# EAGLE schematic Estimulema v2 (EAGLE 9.1.0)

## Sheet 1 of 12
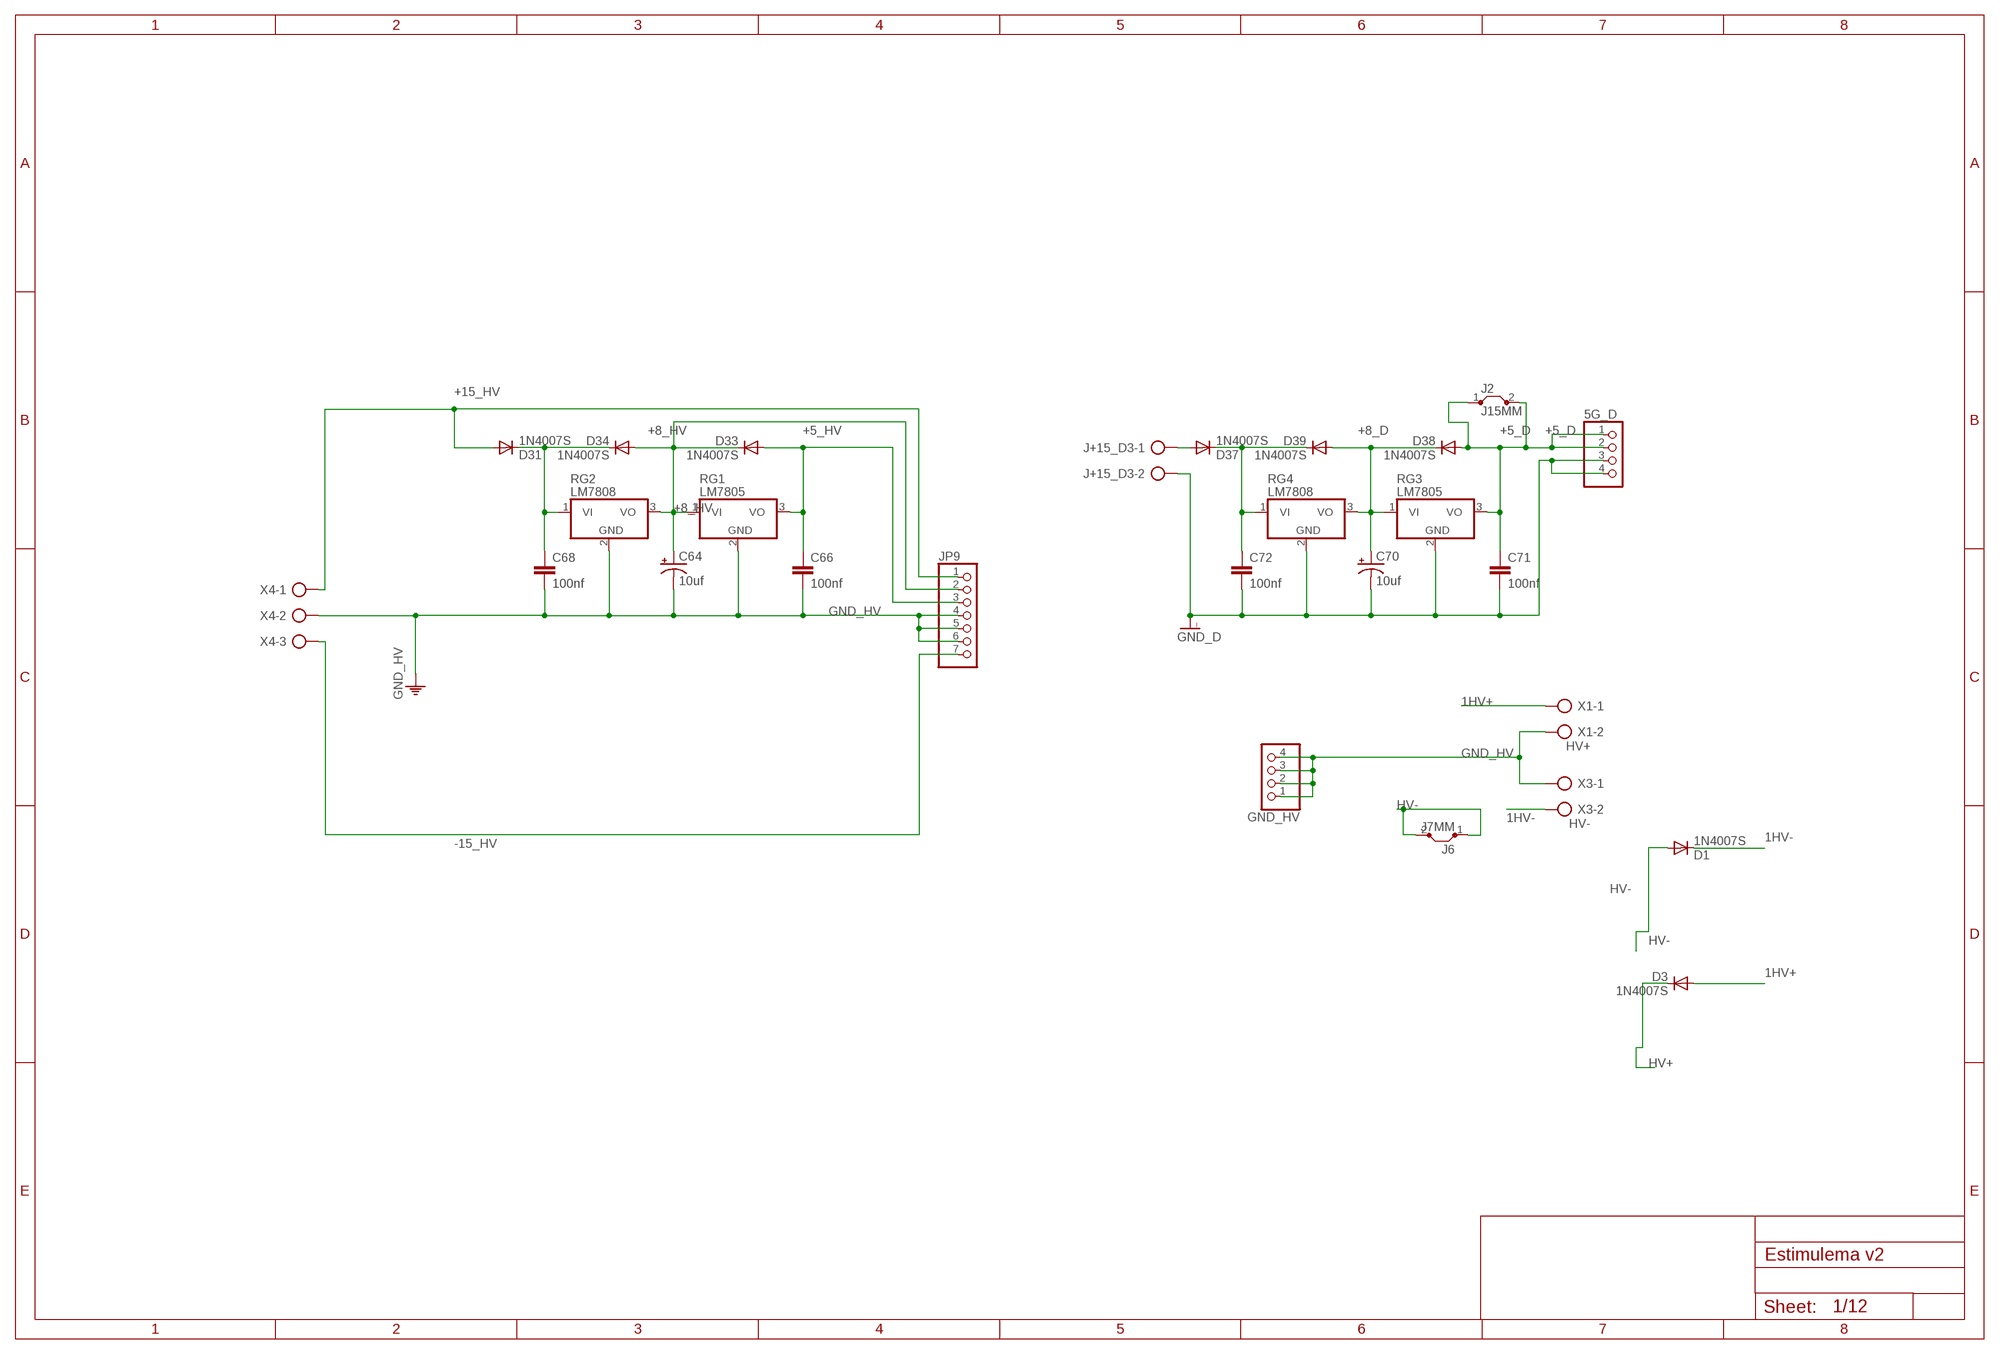
[diagram p0: schematic, sheet 1]

### Parts
5G_D  PINHD-1X4  [1X04]
C64  10uf  CPOL-USE2-5  [E2-5]
C66  100nf  C-EU025-024X044  [C025-024X044]
C68  100nf  C-EU025-024X044  [C025-024X044]
C70  10uf  CPOL-USE2-5  [E2-5]
C71  100nf  C-EU025-024X044  [C025-024X044]
C72  100nf  C-EU025-024X044  [C025-024X044]
D1  1N4007S  DIODO  [DIODO4MM]
D3  1N4007S  DIODO  [DIODO4MM]
D31  1N4007S  DIODO  [DIODO4MM]
D33  1N4007S  DIODO  [DIODO4MM]
D34  1N4007S  DIODO  [DIODO4MM]
D37  1N4007S  DIODO  [DIODO4MM]
D38  1N4007S  DIODO  [DIODO4MM]
D39  1N4007S  DIODO  [DIODO4MM]
GND_HV  PINHD-1X4  [1X04]
J2  J15MM  JUMPERS15MM  [15]
J6  J7MM  JUMPERS7MM  [07]
J+15_D3  AK300/2  [AK300/2]
JP9  PINHD-1X7  [1X07]
RG1  LM7805  7805TV  [TO220V]
RG2  LM7808  7818TV  [TO220V]
RG3  LM7805  7805TV  [TO220V]
RG4  LM7808  7818TV  [TO220V]
X1  HV+  AK300/2  [AK300/2]
X3  HV-  AK300/2  [AK300/2]
X4  AK300/3  [AK300/3]

### Nets
1HV+ [GND_D]: D3.A X1.1
1HV- [GND_D]: D1.C X3.2
+5_D [+5_D]: 5G_D.1 5G_D.2 C71.1 D38.A J2.1 J2.2 RG3.3(VO) ; also sheet 2,5,6,11,12
+5_HV [+5_D]: C66.1 D33.A JP9.3 RG1.3(VO) ; also sheet 2,6
+8_D [SIGNAL]: C70.+ D38.C D39.A RG3.1(VI) RG4.3(VO)
+8_HV [SIGNAL]: C64.+ D33.C D34.A JP9.2 RG1.1(VI) RG2.3(VO)
+15_HV [SIGNAL]: D31.A JP9.1 X4.1 ; also sheet 3,4
-15_HV [SIGNAL]: JP9.7 X4.3 ; also sheet 3,4
GND_D [GND_D]: 5G_D.3 5G_D.4 C70.- C71.2 C72.2 J+15_D3.2 RG3.2(GND) RG4.2(GND) ; also sheet 2,5,11,12
GND_HV [GND_HV1]: C64.- C66.2 C68.2 GND_HV.1 GND_HV.2 GND_HV.3 GND_HV.4 JP9.4 JP9.5 JP9.6 RG1.2(GND) RG2.2(GND) X1.2 X3.1 X4.2 ; also sheet 2,3,4,5,6,10
HV+ [GND_D]: D3.C ; also sheet 3,4,10
HV- [GND_D]: D1.A J6.1 J6.2 ; also sheet 3,4,10
N$9: D37.A J+15_D3.1
N$157 [SIGNAL]: C68.1 D31.C D34.C RG2.1(VI)
N$158 [SIGNAL]: C72.1 D37.C D39.C RG4.1(VI)

## Sheet 2 of 12
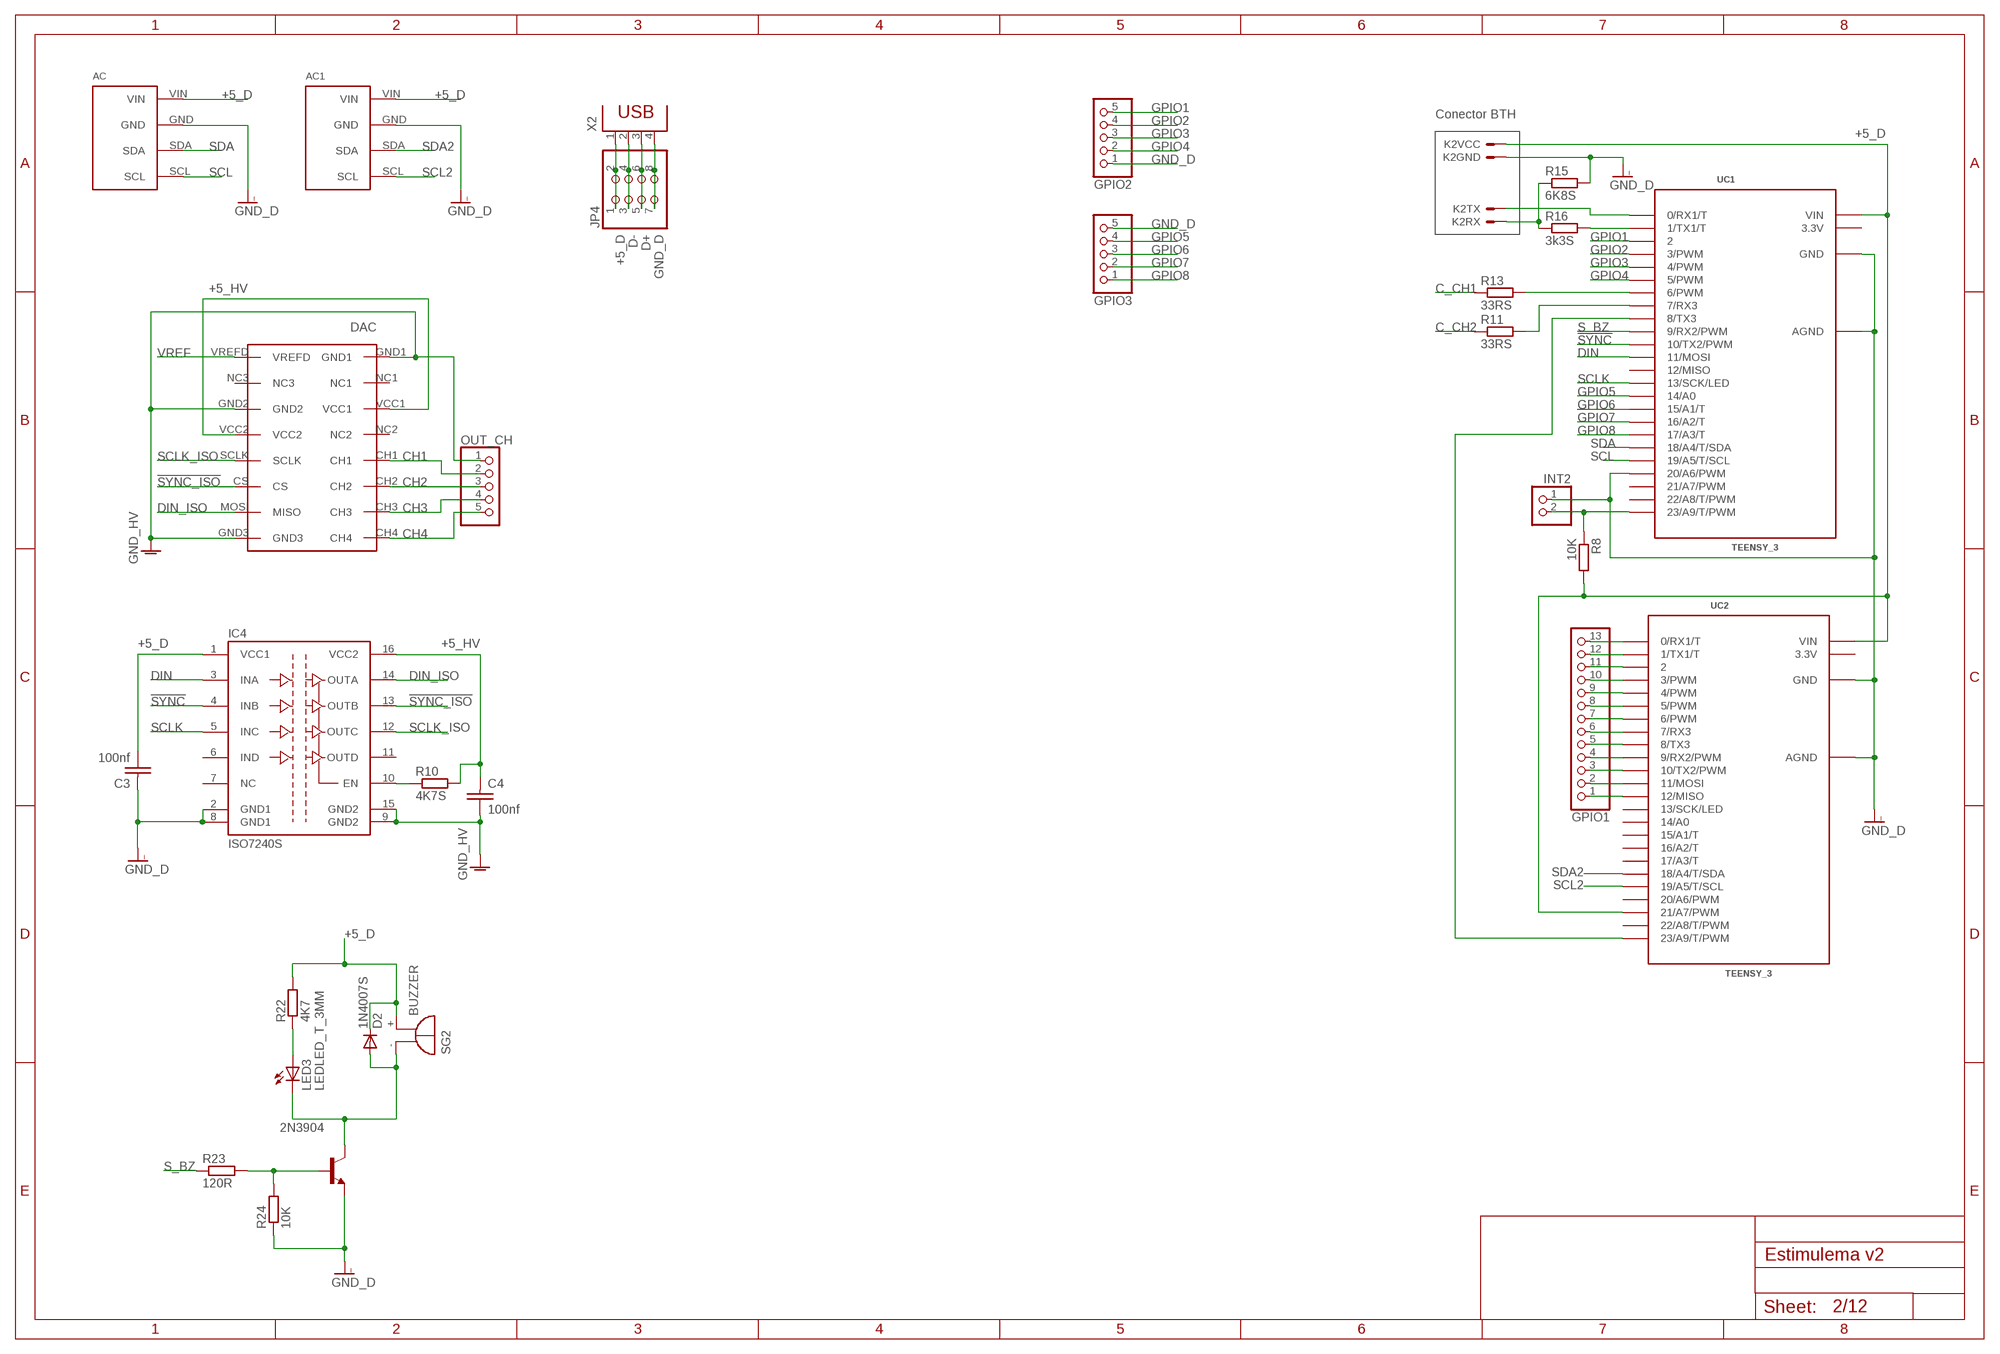
[diagram p1: schematic, sheet 2]

### Parts
2N3904  29-NPN-TO92-EBC  [TO92-EBC]
AC  CONECTOR_ACELEROMETRO_MPU6050CONECTOR_MPU6050  [MPU6050]
AC1  MPU6050  CONECTOR_ACELEROMETRO_MPU6050CONECTOR_MPU6050  [MPU6050]
C3  100nf  CAP_CERAMICO_SMD  [CAP_CER_SMD-0805]
C4  100nf  CAP_CERAMICO_SMD  [CAP_CER_SMD-0805]
D2  1N4007S  DIODO  [DIODO4MM]
DAC  DAC_MODULE  [DACMOD_P]
GPIO1  PINHD-1X13  [1X13]
GPIO2  PINHD-1X5  [1X05]
GPIO3  PINHD-1X5  [1X05]
IC4  ISO7240S  ISO7240_SMDDW  [SO-16DW]
INT2  PINHD-1X2  [1X02]
JP4  PINHD-2X4  [2X04]
K2  HC-06  CONECTOR_BTHC-06HC-06  [CONECTOR_BTHC-06]
LED3  LEDLED_T_3MM  [LED3MM]
OUT_CH  PINHD-1X5  [1X05]
R8  10K  RESISTORSMD_0805  [RESISTENCIA_0805]
R10  4K7S  RESISTORSMD_0805  [RESISTENCIA_0805]
R11  33RS  RESISTORSMD_0805  [RESISTENCIA_0805]
R13  33RS  RESISTORSMD_0805  [RESISTENCIA_0805]
R15  6K8S  RESISTORSMD_0805  [RESISTENCIA_0805]
R16  3k3S  RESISTORSMD_0805  [RESISTENCIA_0805]
R22  4K7  RESISTORSMD_0805  [RESISTENCIA_0805]
R23  120R  RESISTORSMD_0805  [RESISTENCIA_0805]
R24  10K  RESISTORSMD_0805  [RESISTENCIA_0805]
SG2  BUZZER  [BUZZER]
UC1  TEENSY_3  TEENSY_3.0_A_3.2VERSION_MINIMA  [TEENSY_3.0-3.2_DIL]
UC2  TEENSY_3  TEENSY_3.0_A_3.2VERSION_MINIMA  [TEENSY_3.0-3.2_DIL]
X2  PN61729  [PN61729]

### Nets
!SYNC [SIGNAL]: IC4.4(INB) UC1.10(10/TX2/PWM) ; also sheet 6,12
!SYNC_ISO [SIGNAL]: DAC.CS IC4.13(OUTB) ; also sheet 6
+5_D [+5_D]: AC1.VIN AC.VIN C3.2 D2.C IC4.1(VCC1) JP4.1 JP4.2 K2.1 R8.2 R22.2 SG2.+(-) UC1.VIN UC2.21/A7(21/A7/PWM) UC2.VIN X2.1 ; also sheet 1,5,6,11,12
+5_HV [+5_D]: C4.1 DAC.VCC1 DAC.VCC2 IC4.16(VCC2) R10.2 ; also sheet 1,6
C_15D [SIGNAL]: GPIO1.11 UC2.2
C_CH1 [SIGNAL]: R13.1 ; also sheet 5,12
C_CH2 [SIGNAL]: R11.1 ; also sheet 5,12
CH1 [SIGNAL]: DAC.CH1 OUT_CH.2 ; also sheet 3,6
CH2 [SIGNAL]: DAC.CH2 OUT_CH.3 ; also sheet 4,6
CH3 [SIGNAL]: DAC.CH3 OUT_CH.4 ; also sheet 6
CH4 [SIGNAL]: DAC.CH4 OUT_CH.5 ; also sheet 6
D+ [SIGNAL]: JP4.5 JP4.6 X2.3
D- [SIGNAL]: JP4.3 JP4.4 X2.2
DIN [SIGNAL]: IC4.3(INA) UC1.11(11/MOSI) ; also sheet 6,12
DIN_ISO [SIGNAL]: DAC.MOSI(MISO) IC4.14(OUTA) ; also sheet 6
GND_D [GND_D]: 2N3904.E AC1.GND AC.GND GPIO2.1 GPIO3.5 INT2.1 JP4.7 JP4.8 K2.2 R15.2 R24.1 UC1.20/A6(20/A6/PWM) UC1.AGND UC1.GND UC2.AGND UC2.GND X2.4 ; also sheet 1,5,11,12
GND_HV [GND_HV1]: C4.2 DAC.GND1 DAC.GND2 DAC.GND3 IC4.9(GND2) IC4.15(GND2) OUT_CH.1 ; also sheet 1,3,4,5,6,10
GNDI [GND_D]: C3.1 IC4.2(GND1) IC4.8(GND1) ; supply symbol labelled GND_D ; also sheet 6
GPIO1 [SIGNAL]: GPIO2.5 UC1.2
GPIO2 [SIGNAL]: GPIO2.4 UC1.3(3/PWM)
GPIO3 [SIGNAL]: GPIO2.3 UC1.4(4/PWM)
GPIO4 [SIGNAL]: GPIO2.2 UC1.5(5/PWM)
GPIO5 [SIGNAL]: GPIO3.4 UC1.14/A0
GPIO6 [SIGNAL]: GPIO3.3 UC1.15/A1(15/A1/T)
GPIO7 [SIGNAL]: GPIO3.2 UC1.16/A2(16/A2/T)
GPIO8 [SIGNAL]: GPIO3.1 UC1.17/A3(17/A3/T)
N$1: UC1.8(8/TX3) UC2.23/A9(23/A9/T/PWM)
N$6: GPIO1.13 UC2.0(0/RX1/T)
N$7: GPIO1.12 UC2.1(1/TX1/T)
N$10: GPIO1.10 UC2.3(3/PWM)
N$11: GPIO1.9 UC2.4(4/PWM)
N$12: GPIO1.8 UC2.5(5/PWM)
N$14: GPIO1.7 UC2.6(6/PWM)
N$15: GPIO1.6 UC2.7(7/RX3)
N$19: GPIO1.5 UC2.8(8/TX3)
N$20: GPIO1.4 UC2.9(9/RX2/PWM)
N$21: GPIO1.3 UC2.10(10/TX2/PWM)
N$22: GPIO1.2 UC2.11(11/MOSI)
N$23: GPIO1.1 UC2.12(12/MISO)
N$66 [SIGNAL]: IC4.10(EN) R10.1
N$67 [SIGNAL]: R13.2 UC1.6(6/PWM)
N$68 [SIGNAL]: R11.2 UC1.7(7/RX3)
N$69 [SIGNAL]: K2.4 R15.1 R16.1
N$70 [SIGNAL]: R16.2 UC1.1(1/TX1/T)
N$71 [SIGNAL]: K2.3 UC1.0(0/RX1/T)
N$72 [SIGNAL]: LED3.A R22.1
N$73 [SIGNAL]: 2N3904.C D2.A LED3.K(C) SG2.-(+)
N$74 [SIGNAL]: 2N3904.B R23.2 R24.2
N$75 [SIGNAL]: INT2.2 R8.1 UC1.23/A9(23/A9/T/PWM)
S_BZ [SIGNAL]: R23.1 UC1.9(9/RX2/PWM)
SCL [SIGNAL]: AC.SCL UC1.19/A5(19/A5/T/SCL)
SCL2: AC1.SCL UC2.19/A5(19/A5/T/SCL) ; also sheet 11,12
SCLK [SIGNAL]: IC4.5(INC) UC1.13(13/SCK/LED) ; also sheet 6,12
SCLK_ISO [SIGNAL]: DAC.SCLK IC4.12(OUTC) ; also sheet 6
SDA [SIGNAL]: AC.SDA UC1.18/A4(18/A4/T/SDA)
SDA2: AC1.SDA UC2.18/A4(18/A4/T/SDA) ; also sheet 11,12
VREF [SIGNAL]: DAC.VREFD ; also sheet 3,4,6
Unconnected: DAC.NC1 DAC.NC2 DAC.NC3 IC4.6(IND) IC4.7(NC) IC4.11(OUTD) UC1.12(12/MISO) UC1.21/A7(21/A7/PWM) UC1.22/A8(22/A8/T/PWM) UC2.13(13/SCK/LED) UC2.14/A0 UC2.15/A1(15/A1/T) UC2.16/A2(16/A2/T) UC2.17/A3(17/A3/T) UC2.20/A6(20/A6/PWM) UC2.22/A8(22/A8/T/PWM)

### Notes on the sheet
- Conector BTH

## Sheet 3 of 12
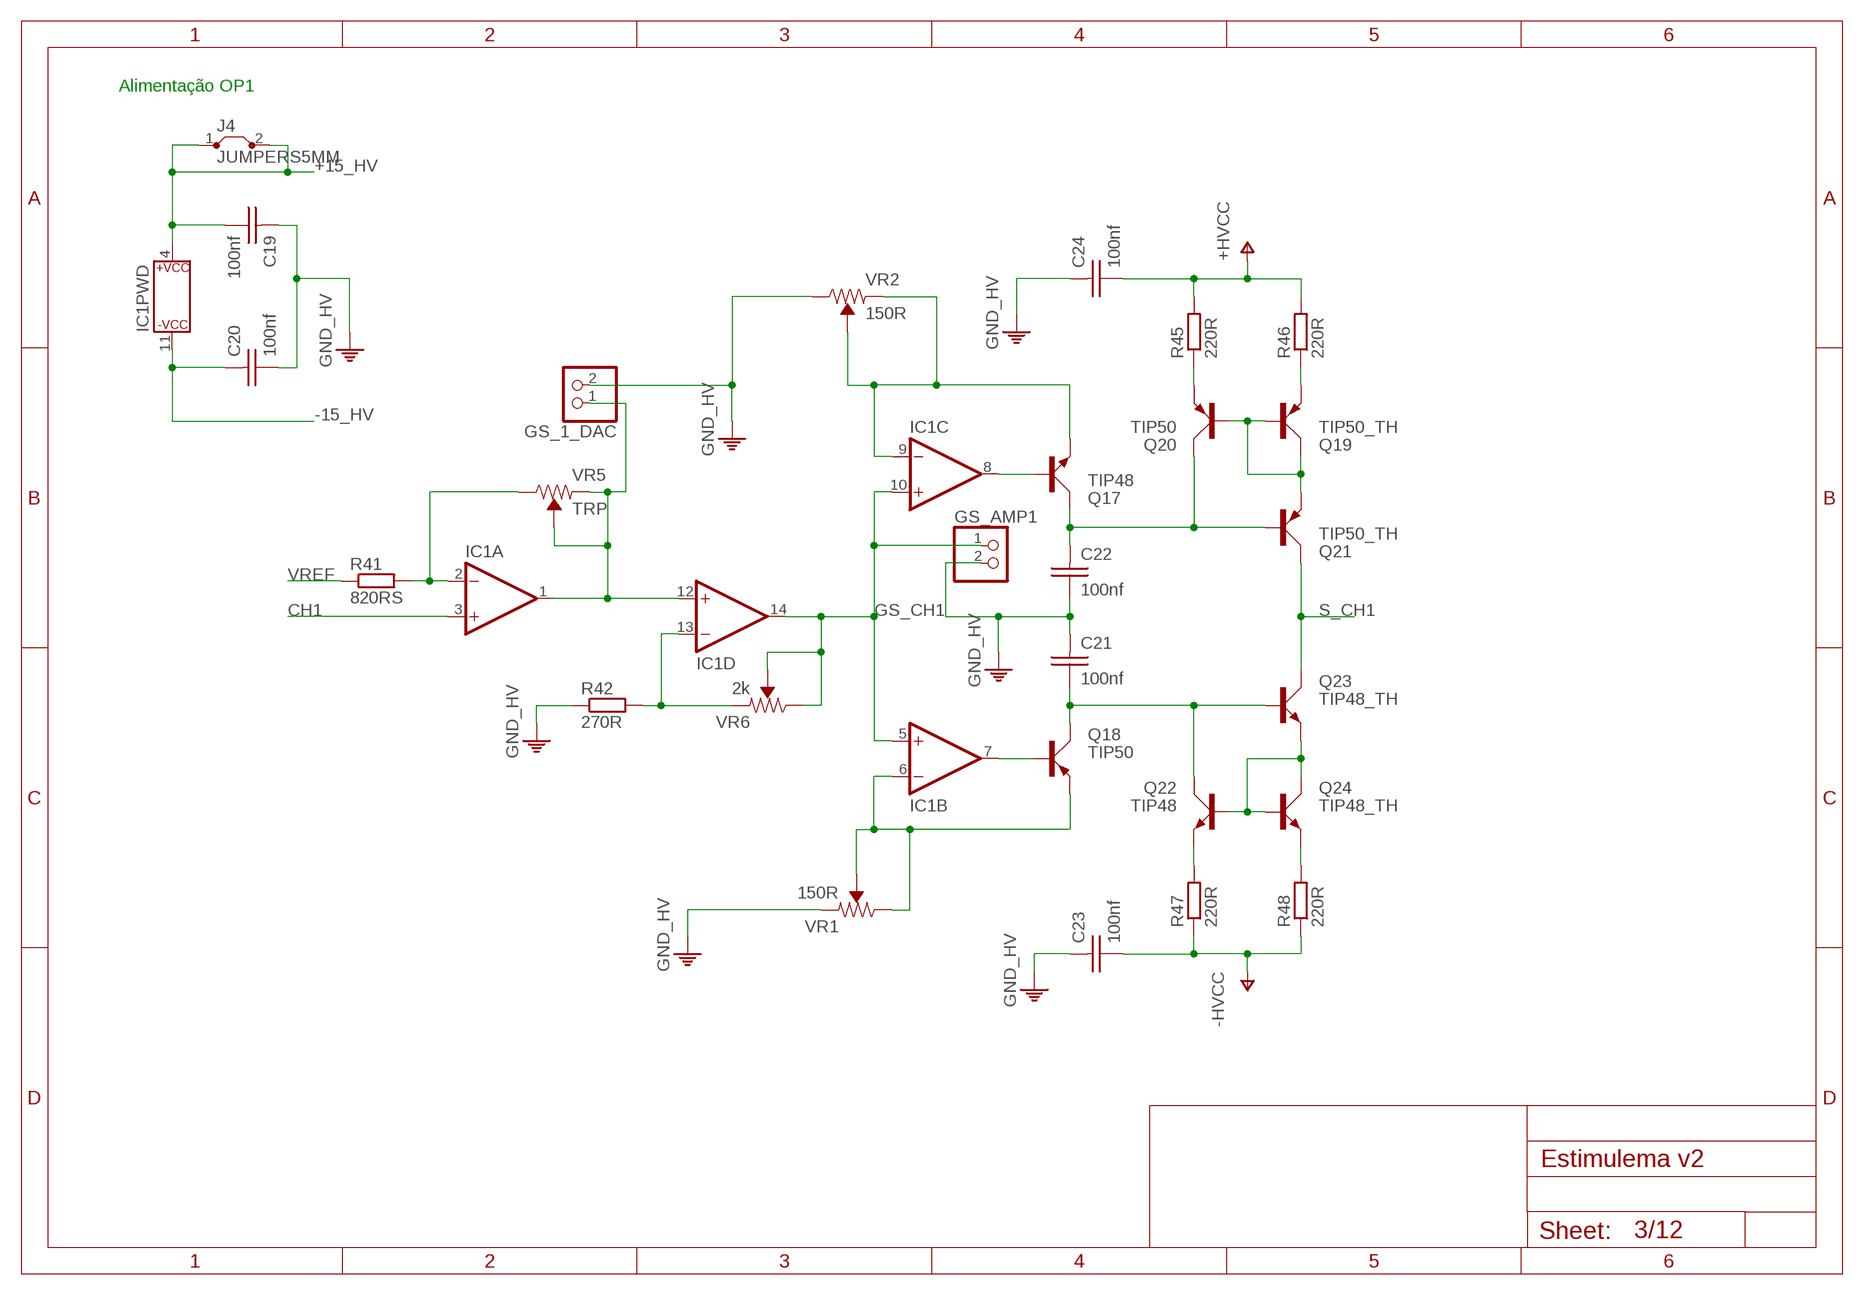
[diagram p2: schematic, sheet 3]

### Parts
C19  100nf  CAP_CERAMICO_SMD  [CAP_CER_SMD-0805]
C20  100nf  CAP_CERAMICO_SMD  [CAP_CER_SMD-0805]
C21  100nf  CAP_CERAMICO_TH2  [CAP_CER_2,54-5X5]
C22  100nf  CAP_CERAMICO_TH2  [CAP_CER_2,54-5X5]
C23  100nf  CAP_CERAMICO_TH16  [CAP_CER_16X7]
C24  100nf  CAP_CERAMICO_TH16  [CAP_CER_16X7]
GS_1_DAC  PINHD-1X2  [1X02]
GS_AMP1  PINHD-1X2  [1X02]
IC1  TL084  [DIL14]
J4  JUMPERS5MM  [05]
Q17  TIP48  TIP48_TH  [TO220]
Q18  TIP50  TIP50_TH  [TO220]
Q19  TIP50_TH  [TO220]
Q20  TIP50  TIP50_TH  [TO220]
Q21  TIP50_TH  [TO220]
Q22  TIP48  TIP48_TH  [TO220]
Q23  TIP48_TH  [TO220]
Q24  TIP48_TH  [TO220]
R41  820RS  RESISTORSMD_0805  [RESISTENCIA_0805]
R42  270R  RESISTORSMD_0805  [RESISTENCIA_0805]
R45  220R  RESISTORT_CORTO  [0204V]
R46  220R  RESISTORT_CORTO  [0204V]
R47  220R  RESISTORT_CORTO  [0204V]
R48  220R  RESISTORT_CORTO  [0204V]
VR1  150R  TRIMPOT_TH  [TRIMPOT-PTH-3386U]
VR2  150R  TRIMPOT_TH  [TRIMPOT-PTH-3386U]
VR5  TRP  TRIMPOT_TH  [TRIMPOT-PTH-3386U]
VR6  2k  TRIMPOT_TH  [TRIMPOT-PTH-3386U]

### Nets
+15_HV [SIGNAL]: C19.2 IC1.4(PWD:P$V+) J4.1 J4.2 ; also sheet 1,4
-15_HV [SIGNAL]: C20.1 IC1.11(PWD:P$V-) ; also sheet 1,4
CH1 [SIGNAL]: IC1.3(A:+IN) ; also sheet 2,6
GND_HV [GND_HV1]: C19.1 C20.2 C21.1 C22.2 C23.1 C24.1 GS_1_DAC.2 GS_AMP1.2 R42.1 VR1.1(CCW) VR2.3(CW) ; also sheet 1,2,4,5,6,10
GS_CH1 [SIGNAL]: GS_AMP1.1 IC1.5(B:+IN) IC1.10(C:+IN) IC1.14(D:OUT) VR6.2(WIPER) VR6.3(CW)
HV+ [GND_D]: C24.2 R45.2 R46.2 ; supply symbol labelled +HVCC ; also sheet 1,4,10
HV- [GND_D]: C23.2 R47.1 R48.1 ; supply symbol labelled -HVCC ; also sheet 1,4,10
N$106 [SIGNAL]: IC1.2(A:-IN) R41.2 VR5.3(CW)
N$107 [SIGNAL]: GS_1_DAC.1 IC1.1(A:OUT) IC1.12(D:+IN) VR5.1(CCW) VR5.2(WIPER)
N$108 [SIGNAL]: IC1.13(D:-IN) R42.2 VR6.1(CCW)
N$109 [SIGNAL]: IC1.9(C:-IN) Q17.E VR2.1(CCW) VR2.2(WIPER)
N$110 [SIGNAL]: IC1.6(B:-IN) Q18.E VR1.2(WIPER) VR1.3(CW)
N$111 [SIGNAL]: C21.2 Q18.C Q22.C Q23.B
N$112 [SIGNAL]: C22.1 Q17.C Q20.C Q21.B
N$113 [SIGNAL]: Q20.E R45.1
N$114 [GND_HV1]: Q19.E R46.1
N$115 [GND_HV1]: Q19.B Q19.C Q20.B Q21.E
N$116 [GND_HV1]: Q22.B Q23.E Q24.B Q24.C
N$117 [SIGNAL]: Q22.E R47.2
N$118 [GND_HV1]: Q24.E R48.2
N$119 [SIGNAL]: IC1.8(C:OUT) Q17.B
N$120 [SIGNAL]: IC1.7(B:OUT) Q18.B
S_CH1 [GND_HV1]: Q21.C Q23.C ; also sheet 5,10
VREF [SIGNAL]: R41.1 ; also sheet 2,4,6

### Notes on the sheet
- Alimentação OP1

## Sheet 4 of 12
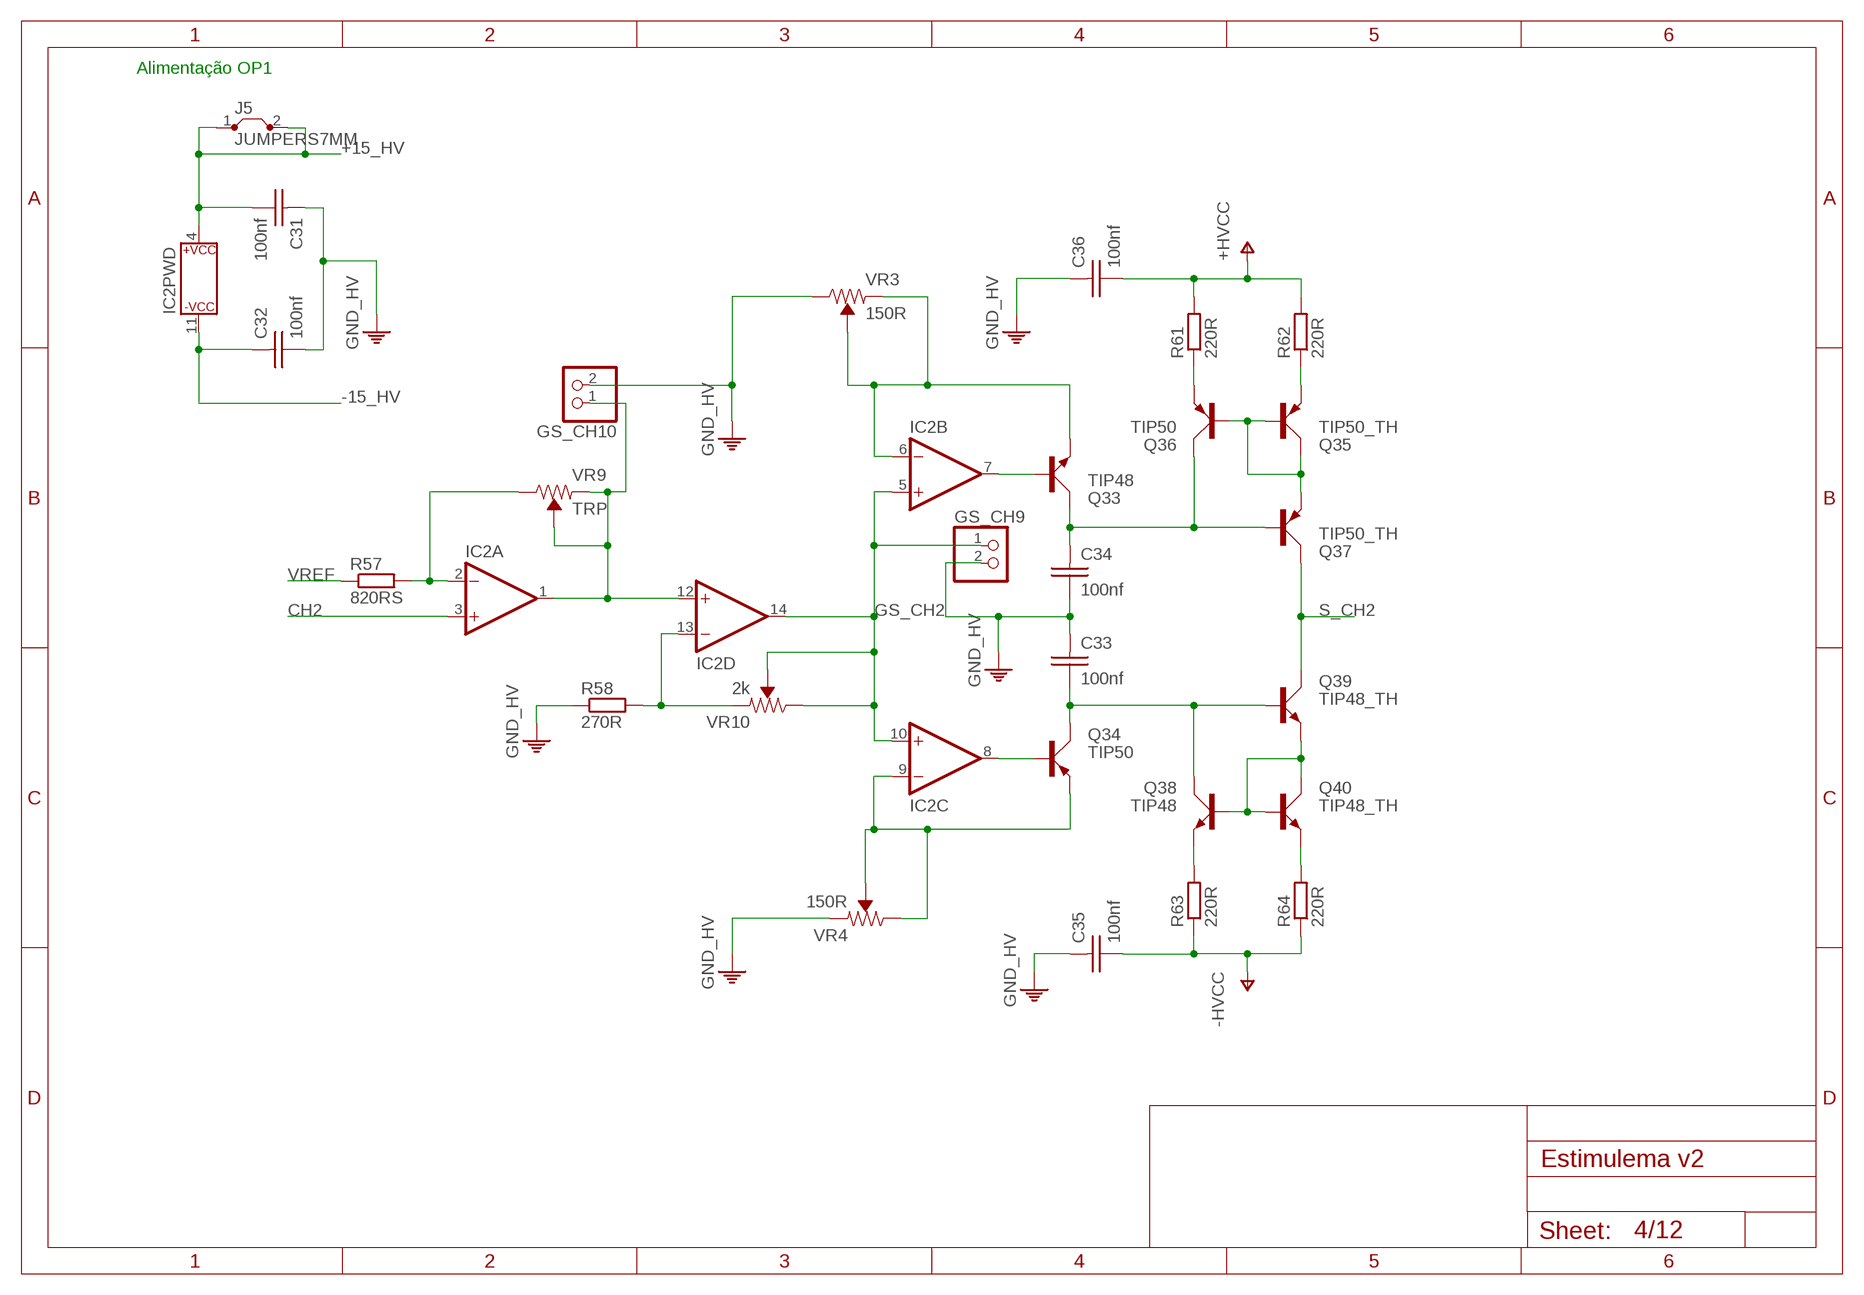
[diagram p3: schematic, sheet 4]

### Parts
C31  100nf  CAP_CERAMICO_SMD  [CAP_CER_SMD-0805]
C32  100nf  CAP_CERAMICO_SMD  [CAP_CER_SMD-0805]
C33  100nf  CAP_CERAMICO_TH2  [CAP_CER_2,54-5X5]
C34  100nf  CAP_CERAMICO_TH2  [CAP_CER_2,54-5X5]
C35  100nf  CAP_CERAMICO_TH16  [CAP_CER_16X7]
C36  100nf  CAP_CERAMICO_TH16  [CAP_CER_16X7]
GS_CH9  PINHD-1X2  [1X02]
GS_CH10  PINHD-1X2  [1X02]
IC2  TL084  [DIL14]
J5  JUMPERS7MM  [07]
Q33  TIP48  TIP48_TH  [TO220]
Q34  TIP50  TIP50_TH  [TO220]
Q35  TIP50_TH  [TO220]
Q36  TIP50  TIP50_TH  [TO220]
Q37  TIP50_TH  [TO220]
Q38  TIP48  TIP48_TH  [TO220]
Q39  TIP48_TH  [TO220]
Q40  TIP48_TH  [TO220]
R57  820RS  RESISTORSMD_0805  [RESISTENCIA_0805]
R58  270R  RESISTORSMD_0805  [RESISTENCIA_0805]
R61  220R  RESISTORT_CORTO  [0204V]
R62  220R  RESISTORT_CORTO  [0204V]
R63  220R  RESISTORT_CORTO  [0204V]
R64  220R  RESISTORT_CORTO  [0204V]
VR3  150R  TRIMPOT_TH  [TRIMPOT-PTH-3386U]
VR4  150R  TRIMPOT_TH  [TRIMPOT-PTH-3386U]
VR9  TRP  TRIMPOT_TH  [TRIMPOT-PTH-3386U]
VR10  2k  TRIMPOT_TH  [TRIMPOT-PTH-3386U]

### Nets
+15_HV [SIGNAL]: C31.2 IC2.4(PWD:P$V+) J5.1 J5.2 ; also sheet 1,3
-15_HV [SIGNAL]: C32.1 IC2.11(PWD:P$V-) ; also sheet 1,3
CH2 [SIGNAL]: IC2.3(A:+IN) ; also sheet 2,6
GND_HV [GND_HV1]: C31.1 C32.2 C33.1 C34.2 C35.1 C36.1 GS_CH9.2 GS_CH10.2 R58.1 VR3.3(CW) VR4.1(CCW) ; also sheet 1,2,3,5,6,10
GS_CH2 [SIGNAL]: GS_CH9.1 IC2.5(B:+IN) IC2.10(C:+IN) IC2.14(D:OUT) VR10.2(WIPER) VR10.3(CW) ; also sheet 6
HV+ [GND_D]: C36.2 R61.2 R62.2 ; supply symbol labelled +HVCC ; also sheet 1,3,10
HV- [GND_D]: C35.2 R63.1 R64.1 ; supply symbol labelled -HVCC ; also sheet 1,3,10
N$136 [SIGNAL]: IC2.2(A:-IN) R57.2 VR9.3(CW)
N$137 [SIGNAL]: GS_CH10.1 IC2.1(A:OUT) IC2.12(D:+IN) VR9.1(CCW) VR9.2(WIPER)
N$138 [SIGNAL]: IC2.13(D:-IN) R58.2 VR10.1(CCW)
N$139 [SIGNAL]: IC2.6(B:-IN) Q33.E VR3.1(CCW) VR3.2(WIPER)
N$140 [SIGNAL]: IC2.9(C:-IN) Q34.E VR4.2(WIPER) VR4.3(CW)
N$141 [SIGNAL]: C33.2 Q34.C Q38.C Q39.B
N$142 [SIGNAL]: C34.1 Q33.C Q36.C Q37.B
N$143 [SIGNAL]: Q36.E R61.1
N$144 [GND_HV1]: Q35.E R62.1
N$145 [GND_HV1]: Q35.B Q35.C Q36.B Q37.E
N$146 [GND_HV1]: Q38.B Q39.E Q40.B Q40.C
N$147 [SIGNAL]: Q38.E R63.2
N$148 [GND_HV1]: Q40.E R64.2
N$149 [SIGNAL]: IC2.7(B:OUT) Q33.B
N$150 [SIGNAL]: IC2.8(C:OUT) Q34.B
S_CH2 [SIGNAL]: Q37.C Q39.C ; also sheet 5
VREF [SIGNAL]: R57.1 ; also sheet 2,3,6

### Notes on the sheet
- Alimentação OP1

## Sheet 5 of 12
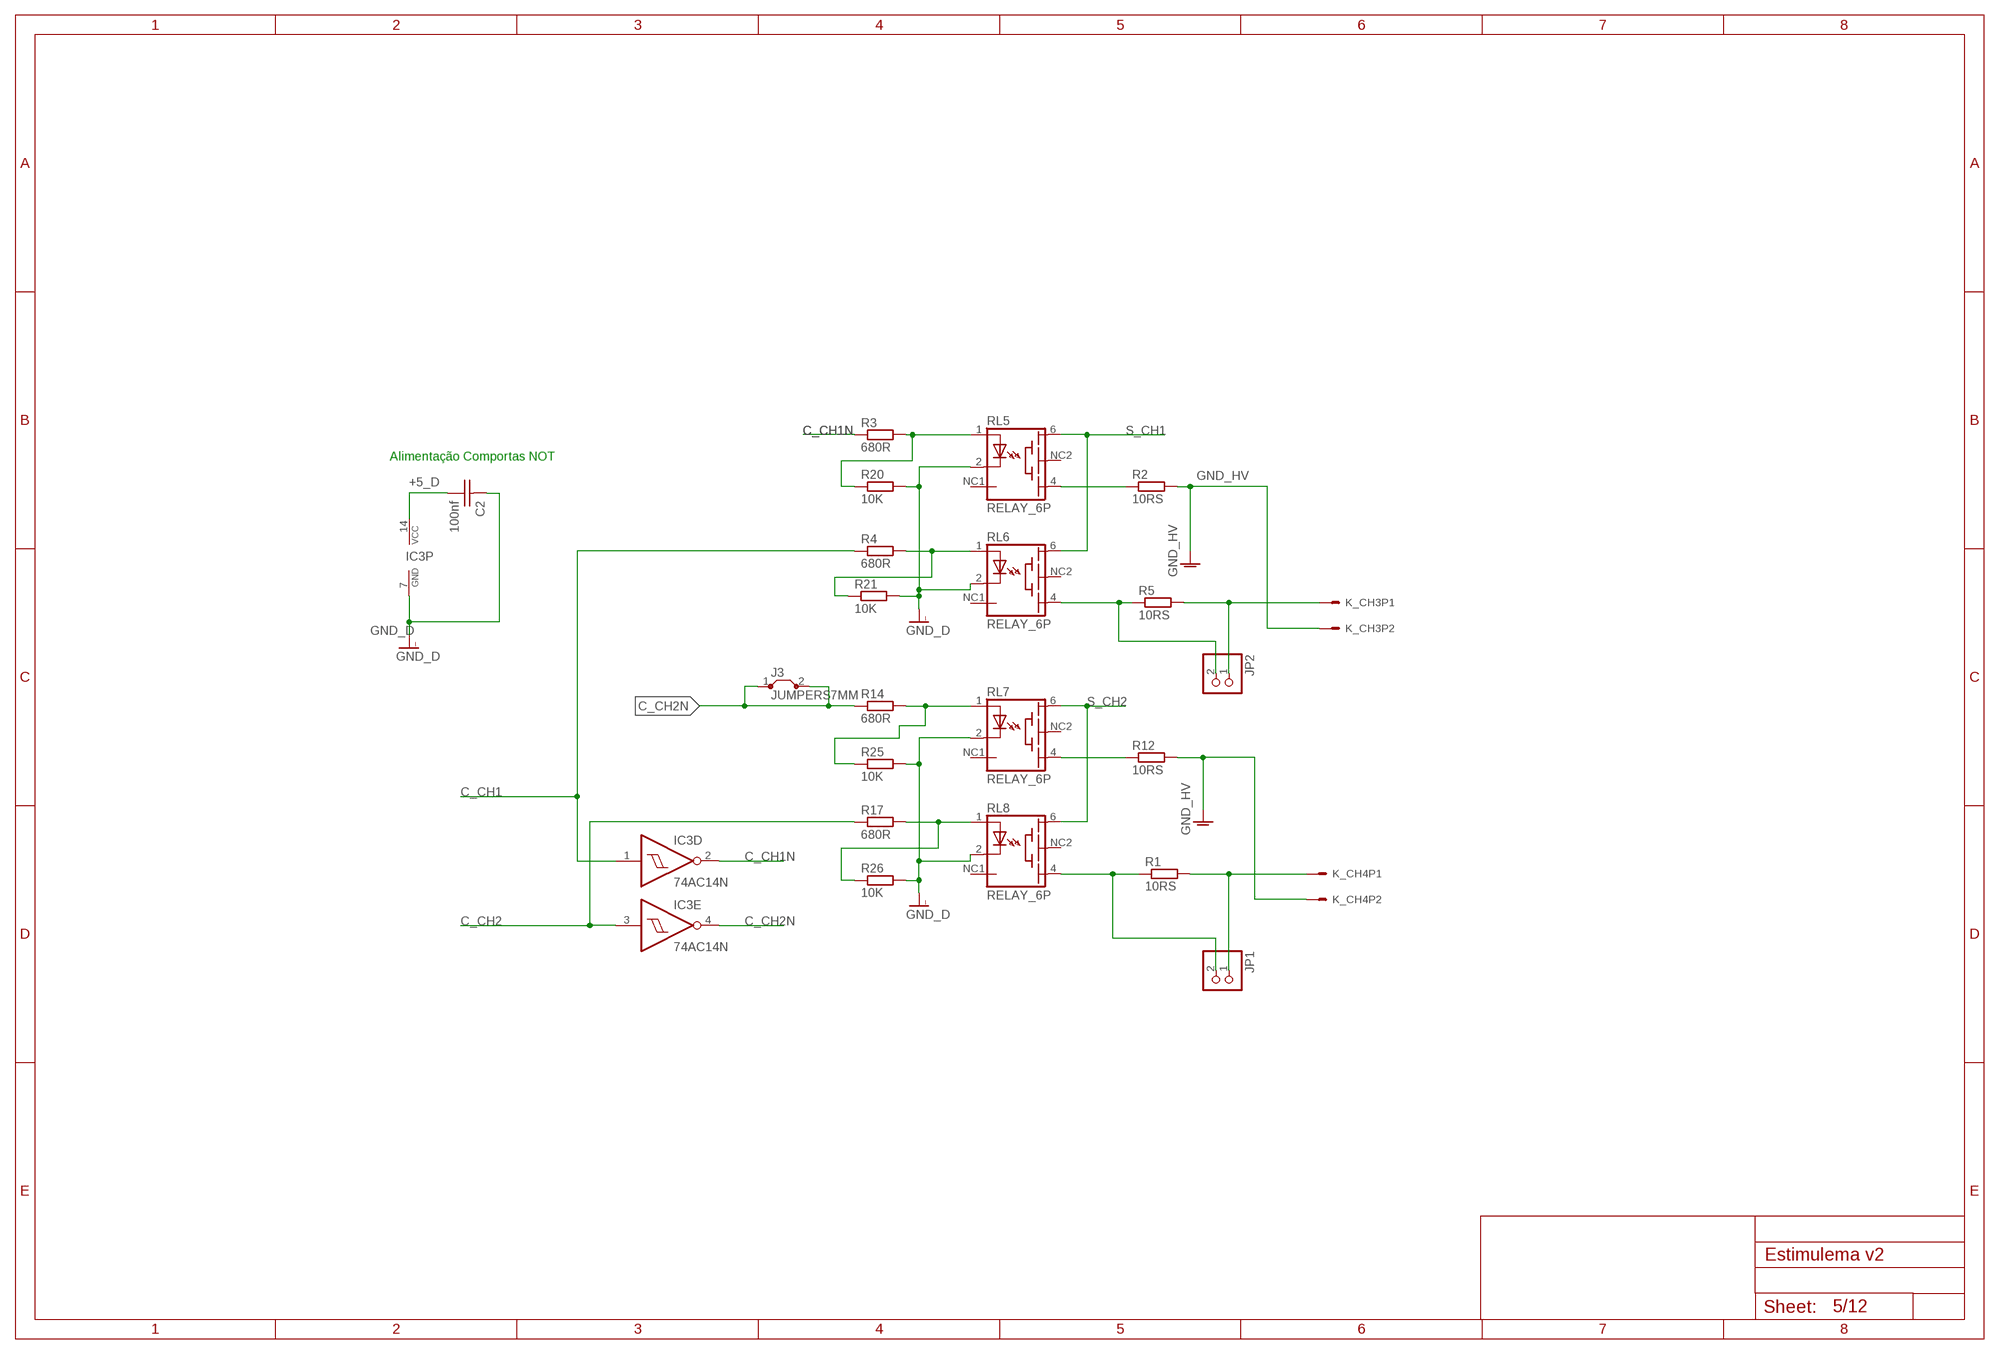
[diagram p4: schematic, sheet 5]

### Parts
C2  100nf  CAP_CERAMICO_SMD  [CAP_CER_SMD-0805]
IC3  74AC14N  [DIL14]
J3  JUMPERS7MM  [07]
JP1  PINHD-1X2  [1X02]
JP2  PINHD-1X2  [1X02]
K_CH3  CONECTOR_5.08  [CONECTOR_X2_5.08]
K_CH4  CONECTOR_5.08  [CONECTOR_X2_5.08]
R1  10RS  RESISTORT_LARGO  [0204/5]
R2  10RS  RESISTORT_GRANDE  [0617V]
R3  680R  RESISTORSMD_0805  [RESISTENCIA_0805]
R4  680R  RESISTORSMD_0805  [RESISTENCIA_0805]
R5  10RS  RESISTORT_LARGO  [0204/5]
R12  10RS  RESISTORT_GRANDE  [0617V]
R14  680R  RESISTORSMD_0805  [RESISTENCIA_0805]
R17  680R  RESISTORSMD_0805  [RESISTENCIA_0805]
R20  10K  RESISTORSMD_0805  [RESISTENCIA_0805]
R21  10K  RESISTORSMD_0805  [RESISTENCIA_0805]
R25  10K  RESISTORSMD_0805  [RESISTENCIA_0805]
R26  10K  RESISTORSMD_0805  [RESISTENCIA_0805]
RL5  RELAY_6P  [TS210]
RL6  RELAY_6P  [TS210]
RL7  RELAY_6P  [TS210]
RL8  RELAY_6P  [TS210]

### Nets
+5_D [+5_D]: C2.2 IC3.14(P:VCC) ; also sheet 1,2,6,11,12
C_CH1 [SIGNAL]: IC3.1(D:I) R4.1 ; also sheet 2,12
C_CH1N [SIGNAL]: IC3.2(D:O) R3.1
C_CH2 [SIGNAL]: IC3.3(E:I) R17.1 ; also sheet 2,12
C_CH2N [SIGNAL]: IC3.4(E:O) J3.1 J3.2 R14.1
GND_D [GND_D]: C2.1 IC3.7(P:GND) R20.2 R21.2 R25.2 R26.2 RL5.2(C) RL6.2(C) RL7.2(C) RL8.2(C) ; also sheet 1,2,11,12
GND_HV [GND_HV1]: K_CH3.2 K_CH4.2 R2.2 R12.2 ; also sheet 1,2,3,4,6,10
N$2 [SIGNAL]: R3.2 R20.1 RL5.1(A)
N$3 [SIGNAL]: R4.2 R21.1 RL6.1(A)
N$4 [GND_HV1]: R2.1 RL5.4(EMI)
N$8: JP2.2 R5.1 RL6.4(EMI)
N$13 [SIGNAL]: R14.2 R25.1 RL7.1(A)
N$16 [SIGNAL]: R17.2 R26.1 RL8.1(A)
N$17 [GND_HV1]: R12.1 RL7.4(EMI)
N$18: JP2.1 K_CH3.1 R5.2
N$25: JP1.1 K_CH4.1 R1.2
N$26: JP1.2 R1.1 RL8.4(EMI)
S_CH1 [GND_HV1]: RL5.6(BAS) RL6.6(BAS) ; also sheet 3,10
S_CH2 [SIGNAL]: RL7.6(BAS) RL8.6(BAS) ; also sheet 4
Unconnected: IC3.5(F:I) IC3.6(F:O) IC3.8(C:O) IC3.9(C:I) IC3.10(B:O) IC3.11(B:I) IC3.12(A:O) IC3.13(A:I) RL5.NC1 RL5.NC2 RL6.NC1 RL6.NC2 RL7.NC1 RL7.NC2 RL8.NC1 RL8.NC2

### Notes on the sheet
- Alimentação Comportas NOT

## Sheet 6 of 12
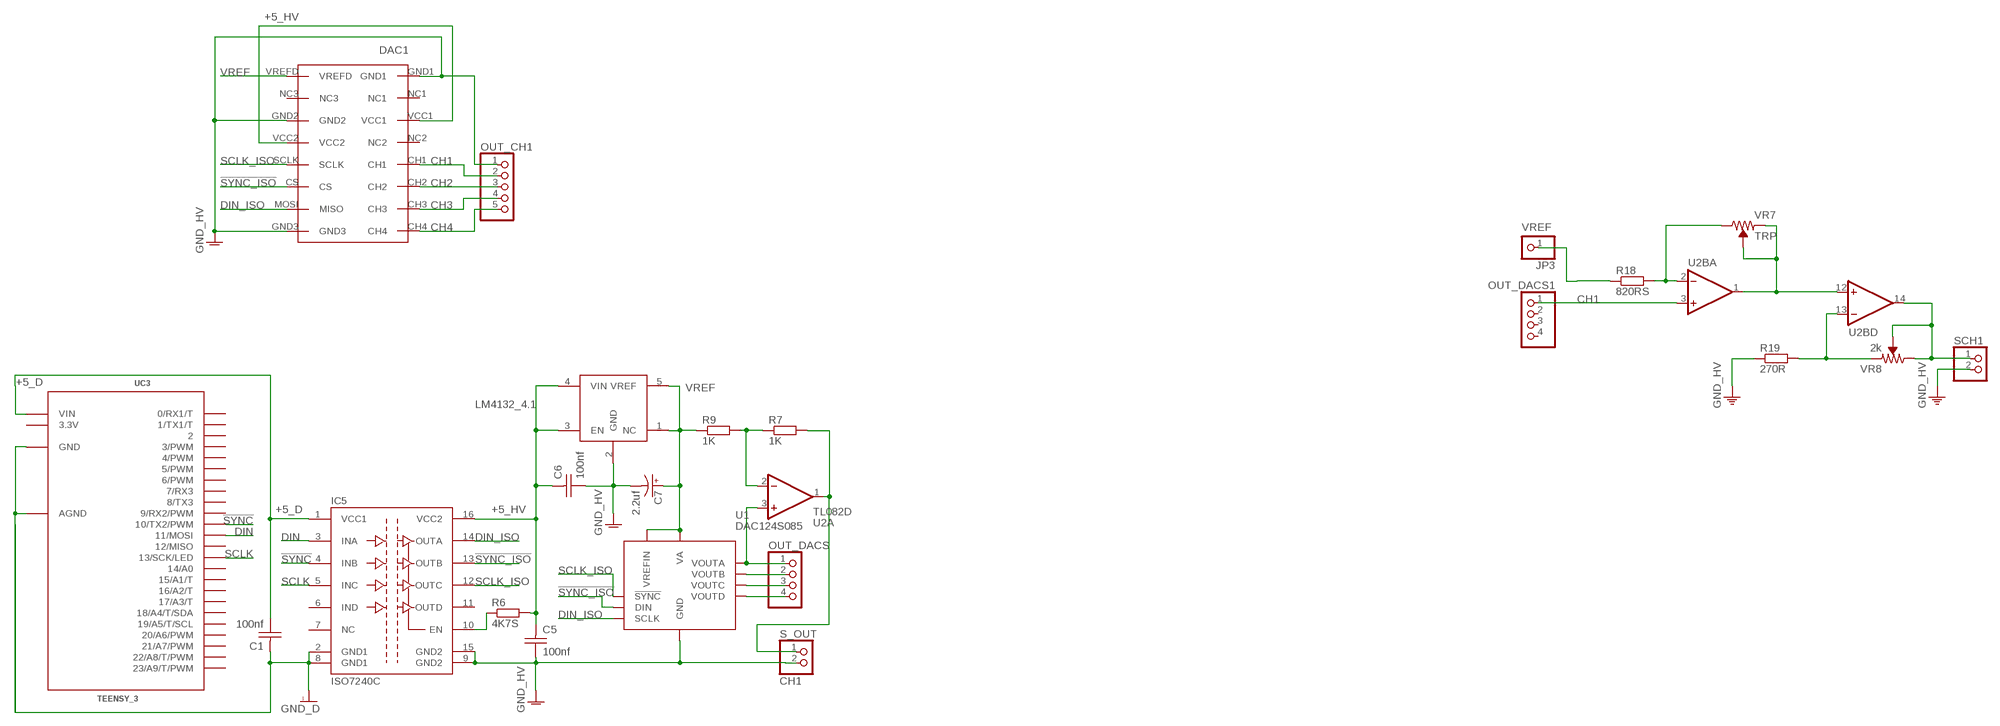
[diagram p5: schematic, sheet 6]

### Parts
C1  100nf  CAP_CERAMICO_SMD  [CAP_CER_SMD-0805]
C5  100nf  CAP_CERAMICO_SMD  [CAP_CER_SMD-0805]
C6  100nf  CAP_CERAMICO_SMD  [CAP_CER_SMD-0805]
C7  2.2uf  CAP_POLARIZADOCAPDAC  [153CLV-0605]
DAC1  DAC_MODULE  [DACMOD_P]
IC5  ISO7240C  ISO7240_SMDDW  [SO-16DW]
JP3  PINHD-1X1  [1X01]
OUT_CH1  PINHD-1X5  [1X05]
OUT_DACS  PINHD-1X4  [1X04]
OUT_DACS1  PINHD-1X4  [1X04]
R6  4K7S  RESISTORSMD_0805  [RESISTENCIA_0805]
R7  1K  RESISTORSMD_0805  [RESISTENCIA_0805]
R9  1K  RESISTORSMD_0805  [RESISTENCIA_0805]
R18  820RS  RESISTORSMD_0805  [RESISTENCIA_0805]
R19  270R  RESISTORSMD_0805  [RESISTENCIA_0805]
S_OUT  CH1  PINHD-1X2  [1X02]
SCH1  PINHD-1X2  [1X02]
U1  DAC124S085  DAC124S085_SMD  [DAC_SO10]
U2  TL082D  [SO08]
U2B  TL084  [DIL14]
U$1  LM4132_4.1  REGULADOR_LM4132_4.1_SMDREGULADOR_ALTA_PRECISION  [SOT23]
UC3  TEENSY_3  TEENSY_3.0_A_3.2VERSION_MINIMA  [TEENSY_3.0-3.2_DIL]
VR7  TRP  TRIMPOT_TH  [TRIMPOT-PTH-3386U]
VR8  2k  TRIMPOT_TH  [TRIMPOT-PTH-3386U]

### Nets
!SYNC [SIGNAL]: IC5.4(INB) UC3.10(10/TX2/PWM) ; also sheet 2,12
!SYNC_ISO [SIGNAL]: DAC1.CS IC5.13(OUTB) U1.8(DIN) ; also sheet 2
+5_D [+5_D]: C1.2 IC5.1(VCC1) UC3.VIN ; also sheet 1,2,5,11,12
+5_HV [+5_D]: C5.1 C6.1 DAC1.VCC1 DAC1.VCC2 IC5.16(VCC2) R6.2 U$1.3(EN) U$1.4(VIN) ; also sheet 1,2
CH1 [SIGNAL]: DAC1.CH1 OUT_CH1.2 OUT_DACS1.1 U2B.3(A:+IN) ; also sheet 2,3
CH2 [SIGNAL]: DAC1.CH2 OUT_CH1.3 ; also sheet 2,4
CH3 [SIGNAL]: DAC1.CH3 OUT_CH1.4 ; also sheet 2
CH4 [SIGNAL]: DAC1.CH4 OUT_CH1.5 ; also sheet 2
DIN [SIGNAL]: IC5.3(INA) UC3.11(11/MOSI) ; also sheet 2,12
DIN_ISO [SIGNAL]: DAC1.MOSI(MISO) IC5.14(OUTA) U1.10(SCLK) ; also sheet 2
GND_HV [GND_HV1]: C5.2 DAC1.GND1 DAC1.GND2 DAC1.GND3 IC5.9(GND2) IC5.15(GND2) OUT_CH1.1 R19.1 S_OUT.2 U1.6(GND) ; also sheet 1,2,3,4,5,10
GNDA: C6.2 C7.- U$1.2(GND) ; supply symbol labelled GND_HV
GNDI [GND_D]: C1.1 IC5.2(GND1) IC5.8(GND1) UC3.AGND UC3.GND ; supply symbol labelled GND_D ; also sheet 2
GS_CH2 [SIGNAL]: SCH1.1 U2B.14(D:OUT) VR8.2(WIPER) VR8.3(CW) ; also sheet 4
N$5: IC5.10(EN) R6.1
N$24: R7.1 R9.2 U2.2(A:-IN)
N$27: OUT_DACS.2 U1.3(VOUTB)
N$28: OUT_DACS.3 U1.4(VOUTC)
N$29: OUT_DACS.4 U1.5(VOUTD)
N$30: C7.+ R9.1 U1.1(VA) U1.7(VREFIN) U$1.1(NC) U$1.5(VREF)
N$31: OUT_DACS.1 U1.2(VOUTA) U2.3(A:+IN)
N$32: R7.2 S_OUT.1 U2.1(A:OUT)
N$33 [SIGNAL]: R18.2 U2B.2(A:-IN) VR7.3(CW)
N$34 [SIGNAL]: U2B.1(A:OUT) U2B.12(D:+IN) VR7.1(CCW) VR7.2(WIPER)
N$35 [SIGNAL]: R19.2 U2B.13(D:-IN) VR8.1(CCW)
PE: SCH1.2 ; supply symbol labelled GND_HV ; also sheet 7,8,10
SCLK [SIGNAL]: IC5.5(INC) UC3.13(13/SCK/LED) ; also sheet 2,12
SCLK_ISO [SIGNAL]: DAC1.SCLK IC5.12(OUTC) U1.9(!SYNC!) ; also sheet 2
VREF [SIGNAL]: DAC1.VREFD JP3.1 R18.1 ; also sheet 2,3,4
Unconnected: DAC1.NC1 DAC1.NC2 DAC1.NC3 IC5.6(IND) IC5.7(NC) IC5.11(OUTD) OUT_DACS1.2 OUT_DACS1.3 OUT_DACS1.4 U2.5(B:+IN) U2.6(B:-IN) U2.7(B:OUT) U2B.4(PWD:P$V+) U2B.5(B:+IN) U2B.6(B:-IN) U2B.7(B:OUT) U2B.8(C:OUT) U2B.9(C:-IN) U2B.10(C:+IN) U2B.11(PWD:P$V-) UC3.0(0/RX1/T) UC3.1(1/TX1/T) UC3.2 UC3.3(3/PWM) UC3.4(4/PWM) UC3.5(5/PWM) UC3.6(6/PWM) UC3.7(7/RX3) UC3.8(8/TX3) UC3.9(9/RX2/PWM) UC3.12(12/MISO) UC3.14/A0 UC3.15/A1(15/A1/T) UC3.16/A2(16/A2/T) UC3.17/A3(17/A3/T) UC3.18/A4(18/A4/T/SDA) UC3.19/A5(19/A5/T/SCL) UC3.20/A6(20/A6/PWM) UC3.21/A7(21/A7/PWM) UC3.22/A8(22/A8/T/PWM) UC3.23/A9(23/A9/T/PWM)

### Notes on the sheet
- LM4132_4.1

## Sheet 7 of 12
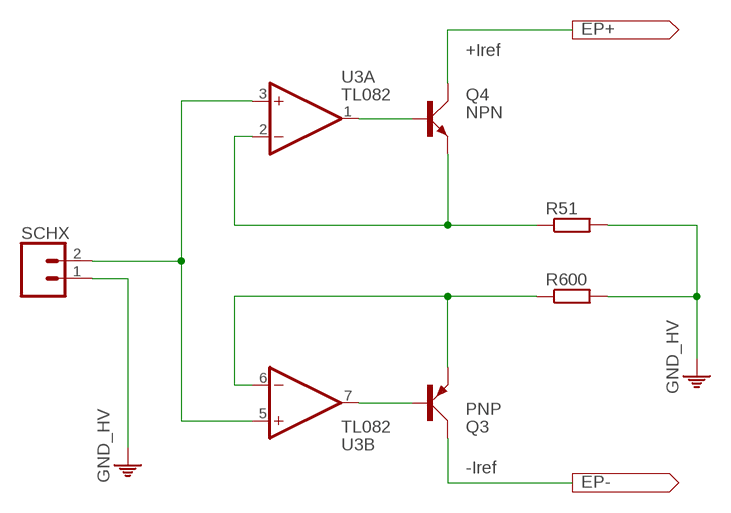
[diagram p6: schematic, sheet 7]

### Parts
Q3  PNP  TIP50_TH  [TO220]
Q4  NPN  TIP48_TH  [TO220]
R51  R-EU_0207/2V  [0207/2V]
R600  R-EU_0207/2V  [0207/2V]
SCHX  CONN_02  [1X02]
U3  TL082  TL082P  [DIL08]

### Nets
N$36: SCHX.2 U3.3(A:+IN) U3.5(B:+IN)
N$37: Q4.E R51.1 U3.2(A:-IN)
N$38: Q3.E R600.1 U3.6(B:-IN)
N$39: Q4.B U3.1(A:OUT)
N$40: Q3.B U3.7(B:OUT)
N$41: Q4.C
N$42: Q3.C
N$43: SCHX.1 ; supply symbol labelled GND_HV
PE: R51.2 R600.2 ; supply symbol labelled GND_HV ; also sheet 6,8,10

### Notes on the sheet
- +Iref
- -Iref

## Sheet 8 of 12
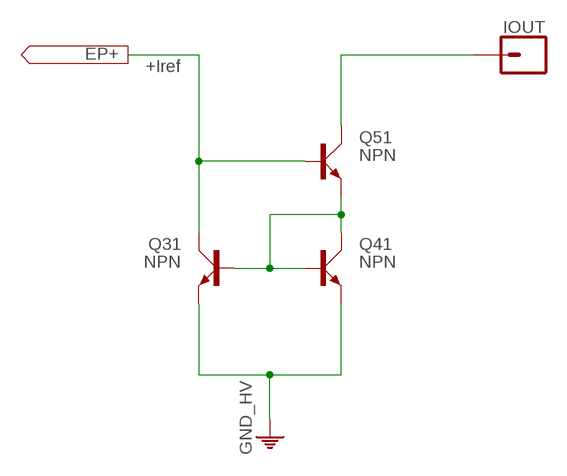
[diagram p7: schematic, sheet 8]

### Parts
IOUT  CONN_01  [1X01]
Q31  NPN  TIP48_TH  [TO220]
Q41  NPN  TIP48_TH  [TO220]
Q51  NPN  TIP48_TH  [TO220]

### Nets
N$44: Q31.C Q51.B
N$45: Q31.B Q41.B Q41.C Q51.E
N$46: IOUT.1 Q51.C
PE: Q31.E Q41.E ; supply symbol labelled GND_HV ; also sheet 6,7,10

### Notes on the sheet
- +Iref

## Sheet 9 of 12
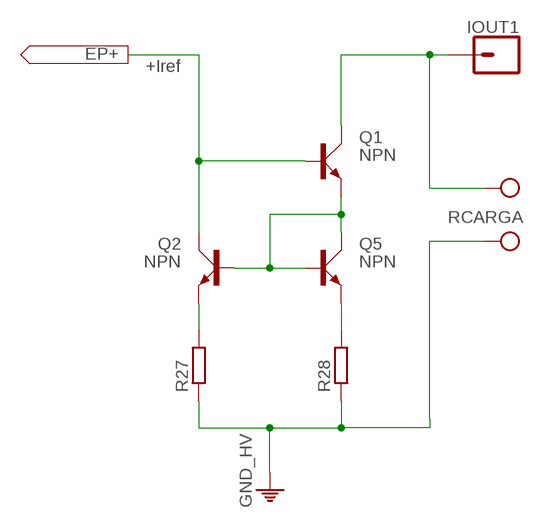
[diagram p8: schematic, sheet 9]

### Parts
IOUT1  CONN_01  [1X01]
Q1  NPN  TIP48_TH  [TO220]
Q2  NPN  TIP48_TH  [TO220]
Q5  NPN  TIP48_TH  [TO220]
R27  R-EU_0204/2V  [0204V]
R28  R-EU_0204/2V  [0204V]

### Nets
N$47: Q1.B Q2.C
N$48: Q1.E Q2.B Q5.B Q5.C
N$49: Q2.E R27.2
N$50: Q5.E R28.2
VDD: IOUT1.1 Q1.C R27.1 R28.1 ; supply symbol labelled GND_HV

### Notes on the sheet
- +Iref
- RCARGA

## Sheet 10 of 12
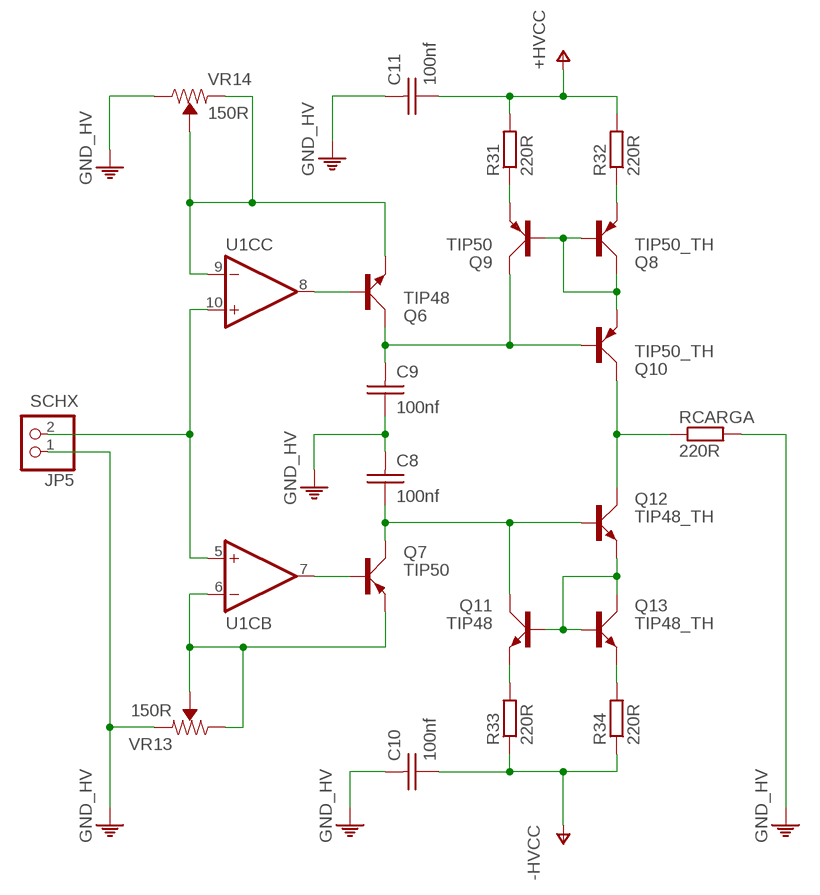
[diagram p9: schematic, sheet 10]

### Parts
C8  100nf  CAP_CERAMICO_TH2  [CAP_CER_2,54-5X5]
C9  100nf  CAP_CERAMICO_TH2  [CAP_CER_2,54-5X5]
C10  100nf  CAP_CERAMICO_TH16  [CAP_CER_16X7]
C11  100nf  CAP_CERAMICO_TH16  [CAP_CER_16X7]
JP5  PINHD-1X2  [1X02]
Q6  TIP48  TIP48_TH  [TO220]
Q7  TIP50  TIP50_TH  [TO220]
Q8  TIP50_TH  [TO220]
Q9  TIP50  TIP50_TH  [TO220]
Q10  TIP50_TH  [TO220]
Q11  TIP48  TIP48_TH  [TO220]
Q12  TIP48_TH  [TO220]
Q13  TIP48_TH  [TO220]
R31  220R  RESISTORT_CORTO  [0204V]
R32  220R  RESISTORT_CORTO  [0204V]
R33  220R  RESISTORT_CORTO  [0204V]
R34  220R  RESISTORT_CORTO  [0204V]
RCARGA  220R  RESISTORT_CORTO  [0204V]
U1C  TL084  [DIL14]
VR13  150R  TRIMPOT_TH  [TRIMPOT-PTH-3386U]
VR14  150R  TRIMPOT_TH  [TRIMPOT-PTH-3386U]

### Nets
GND_HV [GND_HV1]: C8.1 C9.2 C10.1 C11.1 JP5.1 VR13.1(CCW) VR14.3(CW) ; also sheet 1,2,3,4,5,6
HV+ [GND_D]: C11.2 R31.2 R32.2 ; supply symbol labelled +HVCC ; also sheet 1,3,4
HV- [GND_D]: C10.2 R33.1 R34.1 ; supply symbol labelled -HVCC ; also sheet 1,3,4
N$54 [SIGNAL]: Q6.E U1C.9(C:-IN) VR14.1(CCW) VR14.2(WIPER)
N$55 [SIGNAL]: Q7.E U1C.6(B:-IN) VR13.2(WIPER) VR13.3(CW)
N$56 [SIGNAL]: C8.2 Q7.C Q11.C Q12.B
N$57 [SIGNAL]: C9.1 Q6.C Q9.C Q10.B
N$58 [SIGNAL]: Q9.E R31.1
N$59 [GND_HV1]: Q8.E R32.1
N$60 [GND_HV1]: Q8.B Q8.C Q9.B Q10.E
N$61 [GND_HV1]: Q11.B Q12.E Q13.B Q13.C
N$62 [SIGNAL]: Q11.E R33.2
N$63 [GND_HV1]: Q13.E R34.2
N$64 [SIGNAL]: Q6.B U1C.8(C:OUT)
N$65 [SIGNAL]: Q7.B U1C.7(B:OUT)
PE: RCARGA.2 ; supply symbol labelled GND_HV ; also sheet 6,7,8
S_CH1 [GND_HV1]: Q10.C Q12.C RCARGA.1 ; also sheet 3,5
SCHX [SIGNAL]: JP5.2 U1C.5(B:+IN) U1C.10(C:+IN)
Unconnected: U1C.1(A:OUT) U1C.2(A:-IN) U1C.3(A:+IN) U1C.4(PWD:P$V+) U1C.11(PWD:P$V-) U1C.12(D:+IN) U1C.13(D:-IN) U1C.14(D:OUT)

## Sheet 11 of 12
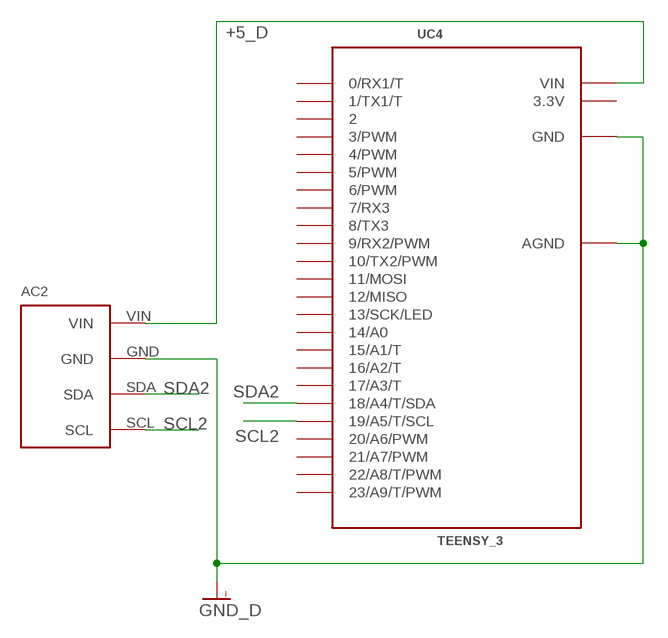
[diagram p10: schematic, sheet 11]

### Parts
AC2  MPU6050  CONECTOR_ACELEROMETRO_MPU6050CONECTOR_MPU6050  [MPU6050]
UC4  TEENSY_3  TEENSY_3.0_A_3.2VERSION_MINIMA  [TEENSY_3.0-3.2_DIL]

### Nets
+5_D [+5_D]: AC2.VIN UC4.VIN ; also sheet 1,2,5,6,12
GND_D [GND_D]: AC2.GND UC4.AGND UC4.GND ; also sheet 1,2,5,12
SCL2: AC2.SCL UC4.19/A5(19/A5/T/SCL) ; also sheet 2,12
SDA2: AC2.SDA UC4.18/A4(18/A4/T/SDA) ; also sheet 2,12
Unconnected: UC4.0(0/RX1/T) UC4.1(1/TX1/T) UC4.2 UC4.3(3/PWM) UC4.4(4/PWM) UC4.5(5/PWM) UC4.6(6/PWM) UC4.7(7/RX3) UC4.8(8/TX3) UC4.9(9/RX2/PWM) UC4.10(10/TX2/PWM) UC4.11(11/MOSI) UC4.12(12/MISO) UC4.13(13/SCK/LED) UC4.14/A0 UC4.15/A1(15/A1/T) UC4.16/A2(16/A2/T) UC4.17/A3(17/A3/T) UC4.20/A6(20/A6/PWM) UC4.21/A7(21/A7/PWM) UC4.22/A8(22/A8/T/PWM) UC4.23/A9(23/A9/T/PWM)

## Sheet 12 of 12
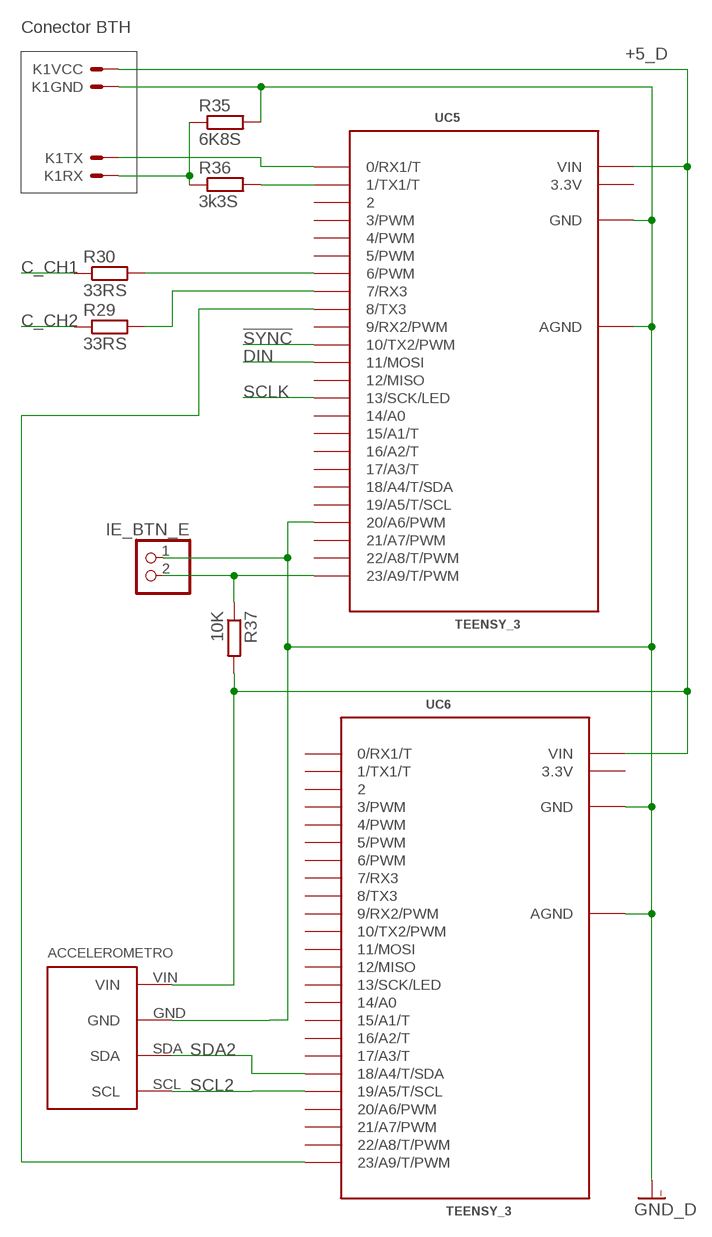
[diagram p11: schematic, sheet 12]

### Parts
ACCELEROMETRO  MPU6050  CONECTOR_ACELEROMETRO_MPU6050CONECTOR_MPU6050  [MPU6050]
IE_BTN_E  PINHD-1X2  [1X02]
K1  HC-06  CONECTOR_BTHC-06HC-06  [CONECTOR_BTHC-06]
R29  33RS  RESISTORSMD_0805  [RESISTENCIA_0805]
R30  33RS  RESISTORSMD_0805  [RESISTENCIA_0805]
R35  6K8S  RESISTORSMD_0805  [RESISTENCIA_0805]
R36  3k3S  RESISTORSMD_0805  [RESISTENCIA_0805]
R37  10K  RESISTORSMD_0805  [RESISTENCIA_0805]
UC5  TEENSY_3  TEENSY_3.0_A_3.2VERSION_MINIMA  [TEENSY_3.0-3.2_DIL]
UC6  TEENSY_3  TEENSY_3.0_A_3.2VERSION_MINIMA  [TEENSY_3.0-3.2_DIL]

### Nets
!SYNC [SIGNAL]: UC5.10(10/TX2/PWM) ; also sheet 2,6
+5_D [+5_D]: ACCELEROMETRO.VIN K1.1 R37.2 UC5.VIN UC6.VIN ; also sheet 1,2,5,6,11
C_CH1 [SIGNAL]: R30.1 ; also sheet 2,5
C_CH2 [SIGNAL]: R29.1 ; also sheet 2,5
DIN [SIGNAL]: UC5.11(11/MOSI) ; also sheet 2,6
GND_D [GND_D]: ACCELEROMETRO.GND IE_BTN_E.1 K1.2 R35.2 UC5.20/A6(20/A6/PWM) UC5.AGND UC5.GND UC6.AGND UC6.GND ; also sheet 1,2,5,11
N$51 [SIGNAL]: R30.2 UC5.6(6/PWM)
N$52 [SIGNAL]: R29.2 UC5.7(7/RX3)
N$53 [SIGNAL]: K1.4 R35.1 R36.1
N$76 [SIGNAL]: R36.2 UC5.1(1/TX1/T)
N$77 [SIGNAL]: K1.3 UC5.0(0/RX1/T)
N$78 [SIGNAL]: IE_BTN_E.2 R37.1 UC5.23/A9(23/A9/T/PWM)
N$79: UC5.8(8/TX3) UC6.23/A9(23/A9/T/PWM)
SCL2: ACCELEROMETRO.SCL UC6.19/A5(19/A5/T/SCL) ; also sheet 2,11
SCLK [SIGNAL]: UC5.13(13/SCK/LED) ; also sheet 2,6
SDA2: ACCELEROMETRO.SDA UC6.18/A4(18/A4/T/SDA) ; also sheet 2,11
Unconnected: UC5.2 UC5.3(3/PWM) UC5.4(4/PWM) UC5.5(5/PWM) UC5.9(9/RX2/PWM) UC5.12(12/MISO) UC5.14/A0 UC5.15/A1(15/A1/T) UC5.16/A2(16/A2/T) UC5.17/A3(17/A3/T) UC5.18/A4(18/A4/T/SDA) UC5.19/A5(19/A5/T/SCL) UC5.21/A7(21/A7/PWM) UC5.22/A8(22/A8/T/PWM) UC6.0(0/RX1/T) UC6.1(1/TX1/T) UC6.2 UC6.3(3/PWM) UC6.4(4/PWM) UC6.5(5/PWM) UC6.6(6/PWM) UC6.7(7/RX3) UC6.8(8/TX3) UC6.9(9/RX2/PWM) UC6.10(10/TX2/PWM) UC6.11(11/MOSI) UC6.12(12/MISO) UC6.13(13/SCK/LED) UC6.14/A0 UC6.15/A1(15/A1/T) UC6.16/A2(16/A2/T) UC6.17/A3(17/A3/T) UC6.20/A6(20/A6/PWM) UC6.21/A7(21/A7/PWM) UC6.22/A8(22/A8/T/PWM)

### Notes on the sheet
- Conector BTH

## Power pins joined to a net without a drawn wire
3.3V: UC1.3.3V UC2.3.3V UC3.3.3V UC4.3.3V UC5.3.3V UC6.3.3V
V+: U2.8(P:V+) U3.8(P:V+)
V-: U2.4(P:V-) U3.4(P:V-)

## Library data of the parts
2N3904 = transistor:*-NPN-: NPN Transistror BF959 corrected 2008.03.06
5G_D GND_HV OUT_DACS OUT_DACS1 = pinhead:PINHD-1X4: PIN HEADER
AC AC1 AC2 ACCELEROMETRO = 7DI Library:CONECTOR_ACELEROMETRO_MPU6050: Conector para el Acelerometro MPU6050 I2C
C1-C6 C8-C11 C19-C24 C31-C36 = 7DI Library:CAP_CERAMICO: Capacitores ceramicos y de poliester, entre otros
C7 = 7DI Library:CAP_POLARIZADO: Capacitor para el dac de 2.2uf
C64 C70 = resistor:CPOL-US: POLARIZED CAPACITOR, American symbol
C66 C68 C71 C72 = resistor:C-EU: CAPACITOR, European symbol
D1-D3 D31 D33 D34 D37-D39 = 7DI Library:DIODO: Diodo usado para protecion en las fuentes de alimentacion
DAC DAC1 = 7DI Library:DAC_MODULE: Modulo feito para o dac com seu regulador
GPIO1 = pinhead:PINHD-1X13: PIN HEADER
GPIO2 GPIO3 OUT_CH OUT_CH1 = pinhead:PINHD-1X5: PIN HEADER
GS_1_DAC GS_AMP1 GS_CH9 GS_CH10 IE_BTN_E INT2 JP1 JP2 JP5 S_OUT SCH1 = pinhead:PINHD-1X2: PIN HEADER
IC1 IC2 U1C U2B = 7DI Library:TL084: IC TL084 Quad Op Amp
IC3 = 74xx-eu:74*14: Hex schmitt trigger INVERTER
IC4 IC5 = 7DI Library:ISO7240_SMD: ISO7240 High Speed Quad Digital Isolators
IOUT IOUT1 = SparkFun-Connectors:CONN_01: Single connection point. Often used as Generic Header-pin footprint for 0.1 inch spaced/style header connections On any of the 0.1 inch spaced packages, you can populate with these: Break Away Headers - Straight <https://www.sparkfun.com/products/116> (PRT-00116) Break Away Male Headers - Right Angle <https://www.sparkfun.com/products/553> (PRT-00553) Female Headers <https://www.sparkfun.com/products/115> (PRT-00115) Break Away Headers - Machine Pin <https://www.sparkfun.com/products/117> (PRT-00117) Break Away Female Headers - Swiss Machine Pin <https://www.sparkfun.com/products/743> (PRT-00743) This device is also useful as a general connection point to wire up your design to another part of your project. Our various solder wires solder well into these plated through hole pads. Hook-Up Wire - Assortment (Stranded, 22 AWG) <https://www.sparkfun.com/products/11375> (PRT-11375) Hook-Up Wire - Assortment (Solid Core, 22 AWG) <https://www.sparkfun.com/products/11367> (PRT-11367) View the entire wire category on our website here <https://www.sparkfun.com/categories/141> Special notes: SMTSO-256-ET is a "flush mount" nut for a 4-40 screw. We mostly use this on specialty testbeds; it is a nice way to connect hardware to your PCB at an adjustable hieght. Also note, the SNAP packages are for using a snappable style connector. We sell a baggie of snaps and they are also used on two LilyPad designs: Snap Assortment - 30 pack (male and female) <https://www.sparkfun.com/products/11347> (DEV-11347) LilyPad Arduino SimpleSnap <https://www.sparkfun.com/products/10941> (DEV-10941) LilyPad SimpleSnap Protoboard <https://www.sparkfun.com/products/10940> (DEV-10940)
J2-J6 = 7DI Library:JUMPERS: Bridge
J+15_D3 X1 X3 = con-ptr500:AK300/2: CONNECTOR; OC_FARNELL: unknown; OC_NEWARK: unknown
JP3 = pinhead:PINHD-1X1: PIN HEADER
JP4 = pinhead:PINHD-2X4: PIN HEADER
JP9 = pinhead:PINHD-1X7: PIN HEADER
K1 K2 = 7DI Library:CONECTOR_BTHC-06: CONECTOR DEL MODULO BLUETOOTH HC-06
K_CH3 K_CH4 = 7DI Library:CONECTOR_: Diferentes tipos de conectores
LED3 = 7DI Library:LED: Diodo led de 3, 5 mm y SMD 0805
Q1 Q2 Q4-Q6 Q11-Q13 Q17 Q22-Q24 Q31 Q33 Q38-Q41 Q51 = 7DI Library:TIP48: NPN TRANSISTOR
Q3 Q7-Q10 Q18-Q21 Q34-Q37 = 7DI Library:TIP50: PNP TRANSISTOR
R1-R26 R29-R37 R41 R42 R45-R48 R57 R58 R61-R64 RCARGA = 7DI Library:RESISTOR: Resistor con varias variantes
R27 R28 R51 R600 = resistor:R-EU_: RESISTOR, European symbol
RG1-RG4 = linear:78*: Positive VOLTAGE REGULATOR Source: http://cache.national.com/ds/LM/LM78L05.pdf http://www.fairchildsemi.com/ds/LM/LM7805.pdf
RL5-RL8 = 7DI Library:RELAY_: Rele de estado solido
SCHX = SparkFun-Connectors:CONN_02: Multi connection point. Often used as Generic Header-pin footprint for 0.1 inch spaced/style header connections On any of the 0.1 inch spaced packages, you can populate with these: Break Away Headers - Straight <https://www.sparkfun.com/products/116> (PRT-00116) Break Away Male Headers - Right Angle <https://www.sparkfun.com/products/553> (PRT-00553) Female Headers <https://www.sparkfun.com/products/115> (PRT-00115) Break Away Headers - Machine Pin <https://www.sparkfun.com/products/117> (PRT-00117) Break Away Female Headers - Swiss Machine Pin <https://www.sparkfun.com/products/743> (PRT-00743) For SCREWTERMINALS and SPRING TERMINALS visit here: Screw Terimnals on SparkFun.com <https://www.sparkfun.com/search/results?term=Screw+Terminals> (5mm/3.5mm/2.54mm spacing) This device is also useful as a general connection point to wire up your design to another part of your project. Our various solder wires solder well into these plated through hole pads. Hook-Up Wire - Assortment (Stranded, 22 AWG) <https://www.sparkfun.com/products/11375> (PRT-11375) Hook-Up Wire - Assortment (Solid Core, 22 AWG) <https://www.sparkfun.com/products/11367> (PRT-11367) View the entire wire category on our website here <https://www.sparkfun.com/categories/141> Special notes: Molex polarized connector foot print use with: PRT-08233 with associated crimp pins and housings. 2.54_SCREWTERM for use with PRT-10571. 3.5mm Screw Terminal footprints for PRT-08084 5mm Screw Terminal footprints for use with PRT-08432
SG2 = 7DI Library:BUZZER: BUZZER Source: Buerklin; OC_FARNELL: unknown; OC_NEWARK: unknown
U1 = 7DI Library:DAC124S085: DAC124S085 4 output 12bit DAC Mfg.: TI, Mfg_Part_No.:DAC124S085CIMM/NOPB, Digikey Part No.; DAC124S085CIMM/NOPBTR-ND, Pkg.: TFSOP-10, MSOP-10, VSSOP-10 Datasheet: http://www.ti.com/lit/ds/symlink/dac124s085.pdf
U2 = 7DI Library:TL082: JFET OP-AMP - Dual
U3 = op-amp:TL082: JFET OP-AMP - Dual
U$1 = 7DI Library:REGULADOR_LM4132_4.1_SMD: Regulador de alta precision LM4132-4.096
UC1-UC6 = 7DI Library:TEENSY_3.0_A_3.2: Unidade de controle baseada em Teensy 3.x
VR1-VR4 VR6 VR8 VR10 VR13 VR14 = 7DI Library:TRIMPOT: Trimming Potentiometer (Trimpot); PROD_ID: ''; SF_SKU: ''; VALUE: TRP
VR5 VR7 VR9 = 7DI Library:TRIMPOT: Trimming Potentiometer (Trimpot); PROD_ID: ''; SF_SKU: ''
X2 = con-berg:PN61729: BERG USB connector; OC_FARNELL: unknown; OC_NEWARK: unknown
X4 = con-ptr500:AK300/3: CONNECTOR; OC_FARNELL: unknown; OC_NEWARK: unknown

## Net classes
1 GND_HV: width 0.813 mm
2 SIGNAL: width 0.508 mm
3 GND_D: width 0.61 mm
4 +5_D: width 0.61 mm
5 GND_HV1: width 0.813 mm